# EAGLE design BQ2000 v3 (EAGLE 7.6.0)
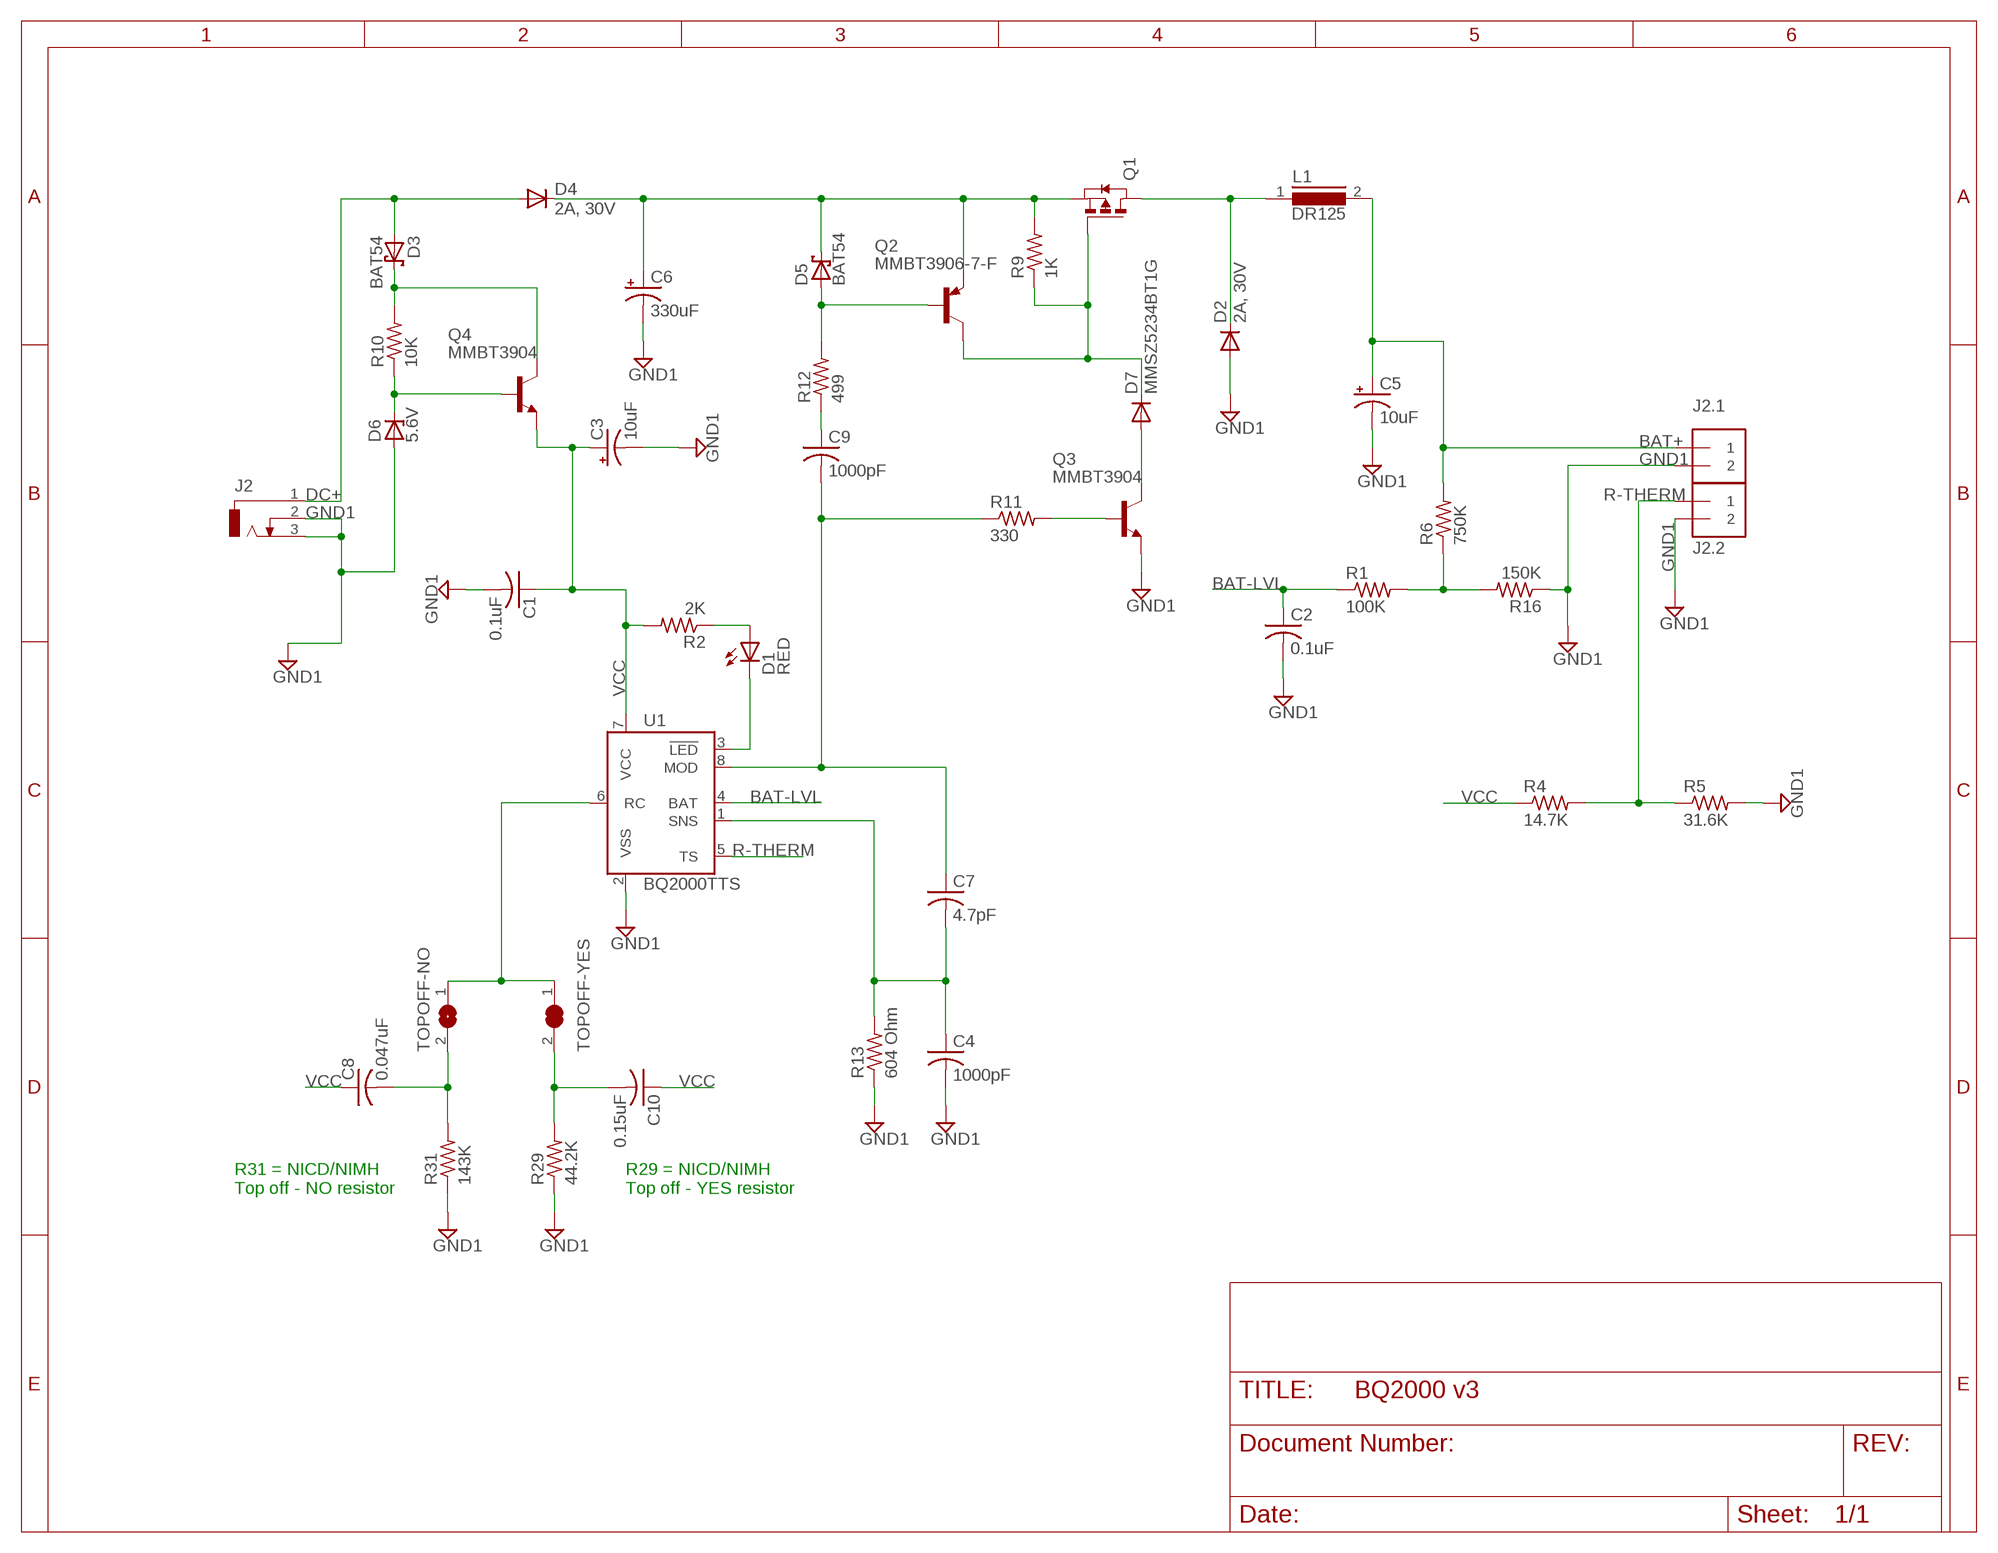
[diagram p0: schematic, sheet 1]

## Parts
C1  0.1uF  C-USC0603K  [C0603K]
C2  0.1uF  C-USC0603K  [C0603K]
C3  10uF  CPOL-USC  [PANASONIC_C]
C4  1000pF  C-USC0603K  [C0603K]
C5  10uF  CPOL-USC  [PANASONIC_C]
C6  330uF  CPOL-USE  [PANASONIC_E]
C7  4.7pF  C-USC0603K  [C0603K]
C8  0.047uF  C-USC0603K  [C0603K]
C9  1000pF  C-USC0603K  [C0603K]
C10  0.15uF  C-USC0603K  [C0603K]
D1  RED  LEDCHIPLED_0805  [CHIPLED_0805]
D2  2A, 30V  DIODE-SMB  [SMB]
D3  BAT54  [SOT23]
D4  2A, 30V  DIODE-SMB  [SMB]
D5  BAT54  [SOT23]
D6  5.6V  ZENER-DIODESOT23  [SOT23]
D7  MMSZ5234BT1G  DIODE-SOD123  [SOD123]
J2  DCJ0303  [DCJ0303]
J2.1  1X2-3.5MM  [1X2-3.5MM]
J2.2  1X2-3.5MM  [1X2-3.5MM]
L1  DR125  [DR125]
Q1  PMOSSOT23-6  [SOT23-6]
Q2  MMBT3906-7-F  MMBT3906LT1-PNP-SOT23-BEC  [SOT23-BEC]
Q3  MMBT3904  MMBT3904LT1-NPN-SOT23-BEC  [SOT23-BEC]
Q4  MMBT3904  MMBT3904LT1-NPN-SOT23-BEC  [SOT23-BEC]
R1  100K  R-US_R0603  [R0603]
R2  2K  R-US_R0603  [R0603]
R4  14.7K  R-US_R0603  [R0603]
R5  31.6K  R-US_R0603  [R0603]
R6  750K  R-US_R0603  [R0603]
R9  1K  R-US_R0603  [R0603]
R10  10K  R-US_R0603  [R0603]
R11  330  R-US_R0603  [R0603]
R12  499  R-US_R0603  [R0603]
R13  604 Ohm  R-US_R0603  [R0603]
R16  150K  R-US_R0603  [R0603]
R29  44.2K  R-US_R0603  [R0603]
R31  143K  R-US_R0603  [R0603]
TOPOFF-NO  SOLDERJUMPER_OPEN  [SOLDERJUMPER_OPEN]
TOPOFF-YES  SOLDERJUMPER_CLOSED"  [SOLDERJUMPER_CLOSED]
U1  BQ2000TTS  [TSSOP8]

## Nets
BAT+: C5.+ J2.1.1 L1.2 R6.2
BAT-LVL: C2.1 R1.1 U1.4(BAT)
DC+: D3.1(A) D4.A J2.1
GND1: C1.2 C2.2 C3.- C4.2 C5.- C6.- D2.A D6.1(A) J2.1.2 J2.2 J2.2.2 J2.3 Q3.E R5.2 R13.1 R16.1 R29.1 R31.1 U1.2(VSS)
N$1: D3.3(C) Q4.C R10.2
N$2: D6.3(C) Q4.B R10.1
N$3: TOPOFF-NO.1 TOPOFF-YES.1 U1.6(RC)
N$5: D1.A R2.1
N$6: D1.C U1.3(!LED)
N$7: C4.1 C7.2 R13.2 U1.1(SNS)
N$8: C7.1 C9.2 R11.1 U1.8(MOD)
N$9: R1.2 R6.1 R16.2
N$10: C6.+ D4.C D5.3(C) Q1.4(S) Q2.E R9.2
N$11: D5.1(A) Q2.B R12.2
N$12: C9.1 R12.1
N$14: Q3.B R11.2
N$15: D7.A Q3.C
N$16: D7.C Q1.3(G) Q2.C R9.1
N$17: D2.C L1.1 Q1.1(D) Q1.2(D) Q1.5(D) Q1.6(D)
N$18: C10.2 R29.2 TOPOFF-YES.2
N$30: C8.2 R31.2 TOPOFF-NO.2
R-THERM: J2.2.1 R4.2 R5.1 U1.5(TS)
VCC: C1.1 C3.+ C8.1 C10.1 Q4.E R2.2 R4.1 U1.7(VCC)

## Notes on the sheet
- R31 = NICD/NIMH
  Top off - NO resistor
- R29 = NICD/NIMH
  Top off - YES resistor

## Library data of the parts
C1 C2 = rcl:C-US: CAPACITOR, American symbol; MPN: C0603C104K5RACTU
C3 C5 = rcl:CPOL-US: POLARIZED CAPACITOR, American symbol; MPN: EEE-FK1E100R
C4 C9 = rcl:C-US: CAPACITOR, American symbol; MPN: C0603C102K5RACTU
C6 = rcl:CPOL-US: POLARIZED CAPACITOR, American symbol; MPN: EEE-FK1E331GP
C7 = rcl:C-US: CAPACITOR, American symbol; MPN: C0603C479D5GACTU
C8 = rcl:C-US: CAPACITOR, American symbol; MPN: C0603C473K3RACTU
C10 = rcl:C-US: CAPACITOR, American symbol; MPN: C0603C154K4RACTU
D1 = led:LED: LED OSRAM: - CHIPLED LG R971, LG N971, LY N971, LG Q971, LY Q971, LO R971, LY R971 LH N974, LH R974 LS Q976, LO Q976, LY Q976 LO Q996 - Hyper CHIPLED LW Q18S LB Q993, LB Q99A, LB R99A - SideLED LS A670, LO A670, LY A670, LG A670, LP A670 LB A673, LV A673, LT A673, LW A673 LH A674 LY A675 LS A676, LA A676, LO A676, LY A676, LW A676 LS A679, LY A679, LG A679 - Hyper Micro SIDELED® LS Y876, LA Y876, LO Y876, LY Y876 LT Y87S - SmartLED LW L88C, LW L88S LB L89C, LB L89S, LG L890 LS L89K, LO L89K, LY L89K LS L896, LA L896, LO L896, LY L896 - TOPLED LS T670, LO T670, LY T670, LG T670, LP T670 LSG T670, LSP T670, LSY T670, LOP T670, LYG T670 LG T671, LOG T671, LSG T671 LB T673, LV T673, LT T673, LW T673 LH T674 LS T676, LA T676, LO T676, LY T676, LB T676, LH T676, LSB T676, LW T676 LB T67C, LV T67C, LT T67C, LS T67K, LO T67K, LY T67K, LW E67C LS E67B, LA E67B, LO E67B, LY E67B, LB E67C, LV E67C, LT E67C LW T67C LS T679, LY T679, LG T679 LS T770, LO T770, LY T770, LG T770, LP T770 LB T773, LV T773, LT T773, LW T773 LH T774 LS E675, LA E675, LY E675, LS T675 LS T776, LA T776, LO T776, LY T776, LB T776 LHGB T686 LT T68C, LB T68C - Hyper Mini TOPLED® LB M676 - Mini TOPLED Santana® LG M470 LS M47K, LO M47K, LY M47K Source: http://www.osram.convergy.de LUXEON: - LUMILED® LXK2-PW12-R00, LXK2-PW12-S00, LXK2-PW14-U00, LXK2-PW14-V00 LXK2-PM12-R00, LXK2-PM12-S00, LXK2-PM14-U00 LXK2-PE12-Q00, LXK2-PE12-R00, LXK2-PE12-S00, LXK2-PE14-T00, LXK2-PE14-U00 LXK2-PB12-K00, LXK2-PB12-L00, LXK2-PB12-M00, LXK2-PB14-N00, LXK2-PB14-P00, LXK2-PB14-Q00 LXK2-PR12-L00, LXK2-PR12-M00, LXK2-PR14-Q00, LXK2-PR14-R00 LXK2-PD12-Q00, LXK2-PD12-R00, LXK2-PD12-S00 LXK2-PH12-R00, LXK2-PH12-S00 LXK2-PL12-P00, LXK2-PL12-Q00, LXK2-PL12-R00 Source: www.luxeon.com KINGBRIGHT: KA-3528ASYC Source: www.kingbright.com; MPN: AP2012SRCPRV
D2 D4 = diode:DIODE-: DIODE; MPN: B230A-13-F
D3 D5 = diode:BAT54: Schottky Diodes Source: Fairchild .. BAT54.pdf; MPN: BAT54
D6 = diode:ZENER-DIODE: Z-Diode; MPN: BZX84C5V6
D7 = diode:DIODE-: DIODE; MPN: MMSZ5234BT1G
J2 = con-jack:DCJ0303: DC POWER JACK Source: DCJ0303.pdf; OC_FARNELL: unknown; OC_NEWARK: unknown
J2.1 J2.2 = adafruit:1X2: 3.5mm Terminal block http://www.ladyada.net/library/pcb/eaglelibrary.html
L1 = inductors:DR125: High Power Density, High Efficiency, Shielded Inductors Source: coiltronics_dr_series.pdf; MPN: CDRH125NP-101MC
Q1 = zetex:PMOSSOT23-6: P-CHANNEL ENHANCEMENT MODE MOSFET Source: Data sheet <http://www.diodes.com/zetex/_pdfs/3.0/pdf/ZXMP10A17E6.pdf> ZXMP10A17E6; MPN: FDC658AP; OC_FARNELL: unknown; OC_NEWARK: unknown
Q2 = transistor:*-PNP-: PNP Transistror; MPN: MMBT3906-7-F
Q3 Q4 = transistor:*-NPN-: NPN Transistror BF959 corrected 2008.03.06
R1 = rcl:R-US_: RESISTOR, American symbol; MPN: CRCW0603100KFKEA
R2 = rcl:R-US_: RESISTOR, American symbol; MPN: CRCW06032K00FKEA
R4 = rcl:R-US_: RESISTOR, American symbol; MPN: CRCW060314K7FKEA
R5 = rcl:R-US_: RESISTOR, American symbol; MPN: CRCW060331K6FKEA
R6 = rcl:R-US_: RESISTOR, American symbol; MPN: CRCW0603750KFKEA
R9 = rcl:R-US_: RESISTOR, American symbol; MPN: CRCW06031K00FKEA
R10 = rcl:R-US_: RESISTOR, American symbol; MPN: CRCW060310K0FKEA
R11 = rcl:R-US_: RESISTOR, American symbol; MPN: CRCW0603330RFKEA
R12 = rcl:R-US_: RESISTOR, American symbol; MPN: CRCW0603499RFKEA
R13 = rcl:R-US_: RESISTOR, American symbol; MPN: CRCW0603604RFKEA
R16 R29 R31 = rcl:R-US_: RESISTOR, American symbol
TOPOFF-NO = ChicagoRobotics:SOLDERJUMPER_OPEN: Solder Jumper - Closed These solder jumpers are closed by default CLOSEDWIRE - 10 mil trace between pads that can be cut and resoldered later
TOPOFF-YES = ChicagoRobotics:SOLDERJUMPER_CLOSED: Solder Jumper - Closed These solder jumpers are closed by default CLOSEDWIRE - 10 mil trace between pads that can be cut and resoldered later
U1 = texas:BQ2000TTS: CHARGE MANAGEMENT IC; MPN: 595-BQ2000PWR; OC_FARNELL: unknown; OC_NEWARK: unknown

## Board
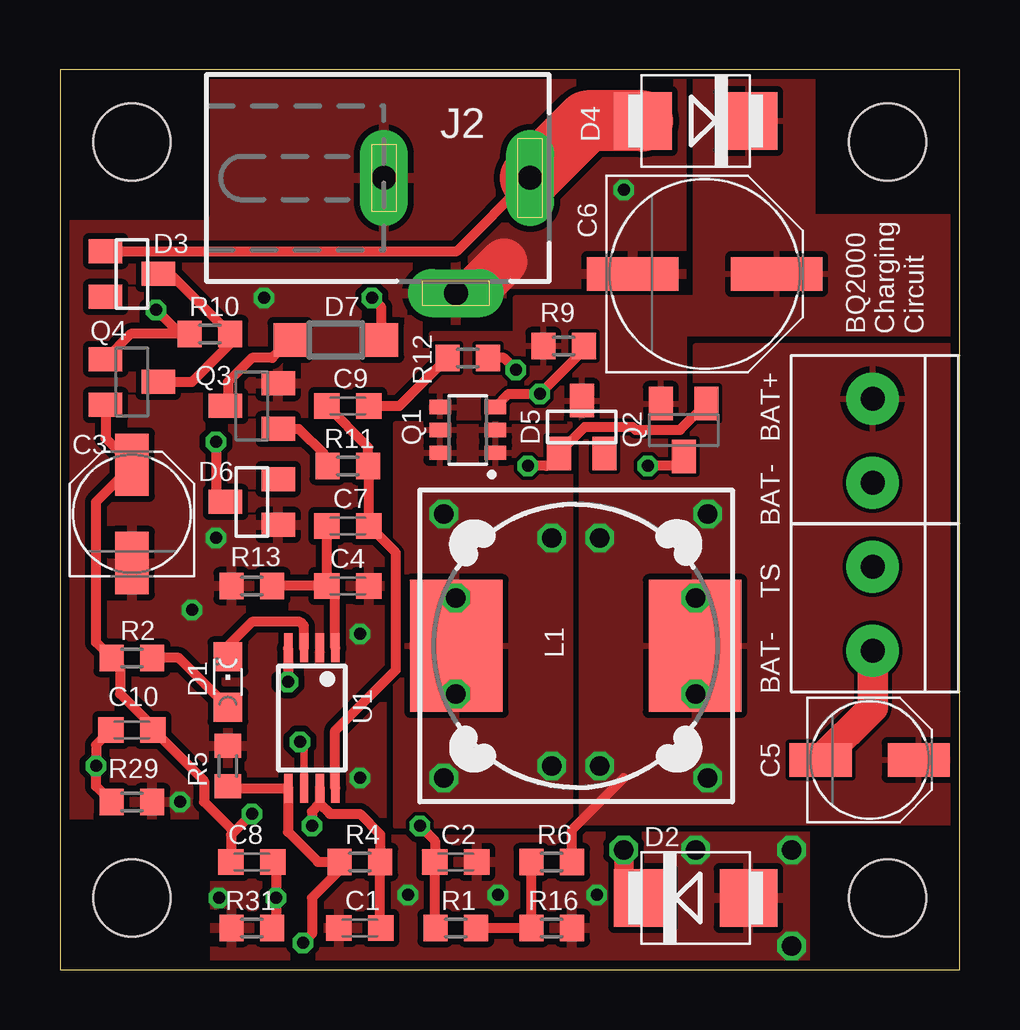
[diagram p1: board, top side]
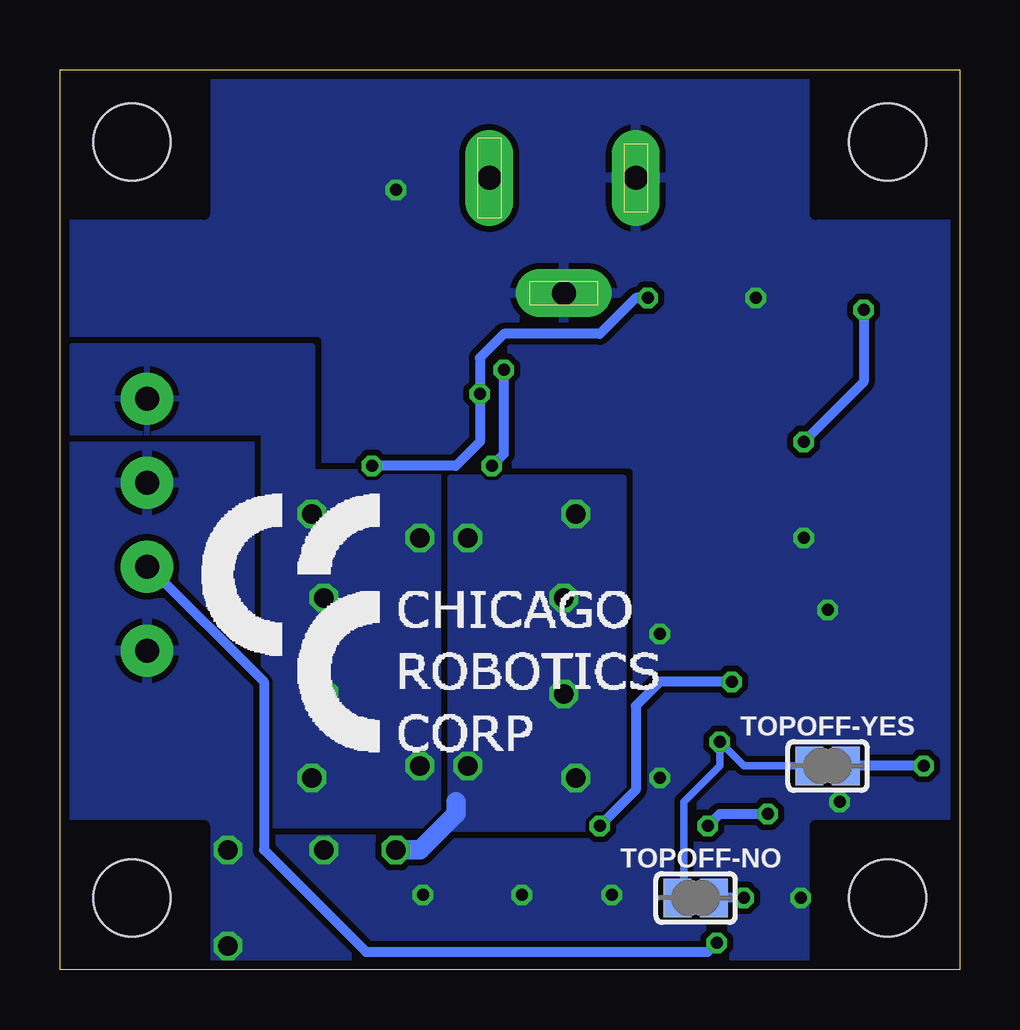
[diagram p2: board, bottom side, seen from below]

Size 37.5 x 37.5 mm. Coordinates in mm from the lower left corner, seen from the top.
Outline: 0,0 37.5,0 37.5,37.5 0,37.5 0,0
Copper layers (1*16): Top 0.0356mm / dielectric 1.5011mm / Bottom 0.0356mm
Design rules "oshpark-2layer *": minimum track width 6mil, minimum drill 13mil, track to track 6mil, track to pad 6mil, pad to pad 6mil, via to via 6mil, smd to smd 6mil, copper to edge 15mil, drill to drill 6mil, minimum pad ring 7mil, minimum via ring 7mil, stop-mask expansion 4mil, vias tented up to drill 0mil, thermal gap 10mil
Holes 3.2 mm at 3,3 3,34.5 34.5,34.5 34.5,3
tRestrict: area 0,0 to 6,6; area 0,31.5 to 6,37.5; area 31.5,0 to 37.5,6; area 31.5,31.5 to 37.5,37.5
bRestrict: area 0,0 to 6,6; area 0,31.5 to 6,37.5; area 31.5,31.5 to 37.5,37.5; area 31.5,0 to 37.5,6

### Footprints (pad centres in the part's own frame; a part is rotated, then mirrored left to right if it is on the bottom)
C0603K = smd 1.05 x 1.08: 1 -0.875,0; 2 0.875,0
PANASONIC_C = smd 2.6 x 1.4: + 2.05,0; - -2.05,0
PANASONIC_E = smd 3.8 x 1.4: + 3,0; - -3,0
CHIPLED_0805 = smd 1.2 x 1.2: A 0,-1.05; C 0,1.05
SMB = smd 2.4 x 2.4: A 2.2,0; C -2.2,0
SOT23 = smd 1 x 1.4: 1 -0.95,-1.1; 2 0.95,-1.1; 3 0,1.1
SOD123 = smd 1.4 x 1.4: A 1.9,0; C -1.9,0
DCJ0303 = drill 1 pad 2 long: 1 0,3.1; 2 4.8,0; 3 0,-3
1X2-3.5MM = drill 1 pad 2.184: 1 1.8,0; 2 -1.7,0
DR125 = smd 3.85 x 5.5: 1 -4.975,0; 2 4.975,0
SOT23-6 = smd 0.6 x 0.9: 1 -0.95,-1.15; 2 0,-1.15; 3 0.95,-1.15; 4 0.95,1.15; 5 0,1.15; 6 -0.95,1.15
SOT23-BEC = smd 1 x 1.4: B -0.95,-1.1; C 0,1.1; E 0.95,-1.1
R0603 = smd 1 x 1.1: 1 -0.85,0; 2 0.85,0
SOLDERJUMPER_OPEN = smd 1.168 x 1.6: 1 -0.762,0; 2 0.762,0
SOLDERJUMPER_CLOSED = smd 1.168 x 1.6: 1 -0.762,0; 2 0.762,0 | smd 1.27 x 0.635: P$1 0,0
TSSOP8 = smd 1.2 x 0.35: 1 -2.925,0.975; 2 -2.925,0.325; 3 -2.925,-0.325; 4 -2.925,-0.975; 5 2.925,-0.975; 6 2.925,-0.325; 7 2.925,0.325; 8 2.925,0.975

### Placement (x,y rotation side)
C1  12.5,1.75 180 top
C2  16.5,4.5 0 top
C3  3,19 90 top
C4  12,16 0 top
C5  33.75,8.75 0 top
C6  26.88,29 0 top
C7  12,18.5 180 top
C8  8,4.5 0 top
C9  12,23.5 180 top
C10  3,10 180 top
D1  7,12 0 top
D2  26.5,3 0 top
D3  3,29 270 top
D4  26.5,35.38 180 top
D5  21.75,22.62 0 top
D6  8,19.5 90 top
D7  11.5,26.25 180 top
J2  16.5,33 270 top
J2.1  33.88,22 90 top
J2.2  33.88,15 90 top
L1  21.5,13.5 0 top
Q1  17,22.5 90 top
Q2  26,22.5 180 top
Q3  8,23.5 90 top
Q4  3,24.5 270 top
R1  16.5,1.75 0 top
R2  3,13 180 top
R4  12.5,4.5 180 top
R5  7,8.5 90 top
R6  20.5,4.5 0 top
R9  21,26 180 top
R10  6.25,26.5 0 top
R11  12,21 180 top
R12  17,25.5 0 top
R13  8,16 0 top
R16  20.5,1.75 180 top
R29  3,7 180 top
R31  8,1.75 0 top
TOPOFF-NO  11,3 0 bottom
TOPOFF-YES  5.5,8.5 0 bottom
U1  10.5,10.5 270 top
U$1  [CRC-LOGO]  22.12,13.62 0 bottom

### Tracks (layer width: path | path; a pad name or v marks a point on that pad's centre or on a via)
BAT+  (via drill 0.8)
  Top 0.406: R6.2 21.35,5.85 23.5,8
  other vias: 22.5,18 27,19 26.5,15.5 22.5,8.5 27,8 26.5,11.5
  pour Top: 21.75,6.12 21.75,22.5 26.5,22.5 26.5,26 37.5,26 37.5,6.12
  pour Bottom: 21.75,20.75 21.75,6 29,6 29,22.38 37,22.38 37,26 27,26 27,20.75
BAT-LVL  (via drill 0.5)
  Top 0.305: R1.1 15.62,1.77 | U1.4 9.5,13.4
  Top 0.406: 15.62,1.77 C2.1 15.62,5.38 v15,6 | 9.5,13.4 v9.5,12
  Bottom 0.406: v9.5,12 12.5,12 13.5,11 13.5,7.5 v15,6
DC+
  Top 0.406: D3.1 16.55,29.95 J2.1
  Top 2.54: D4.A 21.98,35.38 J2.1
GND1  (via drill 0.5, 0.8)
  Top 1.27: J2.2.2 33.88,10.93 C5.-
  Top 1.93: J2.2 17.2,28.2 18.5,29.5
  other vias: 6.62,3 6.5,18 12.5,14 5,7 18.25,3.12 22.38,3.12 14.5,3.12 12.5,8 30.5,5 30.5,1 26.5,5 5.5,15 8.5,28 23.5,32.5
  pour Bottom (isolate 0.254, rank 3): 0,37.5 0,0 37.5,0 37.5,37.5
  pour Top (isolate 0.254, rank 3): 0,37.5 0,0 37.5,0 37.5,37.5
N$1
  Top 0.406: Q4.C 5.5,24.5 7.1,26.1 R10.2 4.6,29 D3.3
N$2  (via drill 0.5)
  Top 0.406: Q4.B 2.95,26.5 R10.1 5,26.5 v4,27.5 | v6.5,22 6.5,19.9 D6.3
  Bottom 0.406: v4,27.5 4,24.5 v6.5,22
N$3  (via drill 0.5)
  Top 0.305: U1.6 10.18,9.32 v10,9.5
  Bottom 0.305: TOPOFF-NO.1 11.5,3.26 11.5,7 10,8.5 v10,9.5 9,8.5 TOPOFF-YES.1
N$5
  Top 0.406: D1.A 4.95,13 R2.1
N$6
  Top 0.305: 7,13.5 D1.C
  Top 0.406: U1.3 10.18,14.32 10,14.5 8,14.5 7,13.5
N$7
  Top 0.305: 11.47,15.65 C4.1
  Top 0.406: U1.1 11.47,15.65 | R13.2 C4.1 C7.2
N$8
  Top 0.305: 12.88,20.98 R11.1
  Top 0.406: U1.8 11.47,9.97 14,12.5 14,17.38 C7.1 12.88,20.98 | R11.1 12.85,21.77 C9.2
N$9
  Top 0.406: R1.2 R16.2 R6.1
N$10
  pour Top: 26.5,37.5 37.5,37.5 37.5,26.5 26,26.5 26,23 15.5,23 15.5,26.5 19,26.5 19,28 26.5,28
N$11  (via drill 0.5)
  Top 0.254: 21.02,21.52 D5.1 20.27,21
  Top 0.406: Q2.B 25.85,22.5 24,22.5 23.88,22.62 21.88,22.62 20.8,21.55 D5.1 | 20.27,21 v19.5,21 | v19,25 18.5,25.5 R12.2
  Bottom 0.406: v19.5,21 19,21.5 v19,25
N$12
  Top 0.406: C9.1 14.15,23.5 R12.1
N$14
  Top 0.406: Q3.B 9.95,22.55 11,21.5 11,21.15 R11.2
N$15
  Top 0.406: D7.A 8.85,25.5 8,25.5 7,24.5 7,23.6 Q3.C
N$16  (via drill 0.5)
  Top 0.254: 21.85,25.85 R9.1 | Q2.C 25.6,21
  Top 0.406: Q1.3 18.7,24 v20,24 21.85,25.85 | 25.6,21 v24.5,21 | D7.C 13.4,27.6 v13,28
  Bottom 0.406: v13,28 13.5,28 15,26.5 19,26.5 20,25.5 v20,24 20,22 21,21 v24.5,21
N$17  (via drill 0.8)
  Top 0.813: L1.1 16.52,11.47 | v23.5,5 23.5,3.8 D2.C
  Bottom 0.813: v23.5,5 22.5,5 21,6.5 21,7
  other vias: 16,8 16.5,11.5 20.5,8.5 16.5,15.5 16,19 20.5,18
  pour Top (rank 2): 14,22.75 21.25,22.75 21.25,6 14,6
  pour Bottom: 14,20.5 21.25,20.5 21.25,5.88 14,5.88
N$18  (via drill 0.5)
  Top 0.406: R29.2 1.5,7.65 v1.5,8.5 1.5,9.38 C10.2
  Bottom 0.406: v1.5,8.5 TOPOFF-YES.2
N$30  (via drill 0.5)
  Top 0.406: C8.2 9,4.38 v9,3 9,1.9 R31.2
  Bottom 0.406: v9,3 TOPOFF-NO.2
R-THERM  (via drill 0.5)
  Top 0.254: U1.5 9.5,7.55
  Top 0.305: R4.2 11.65,4.15
  Top 0.406: R5.1 7.08,7.58 U1.5 | 9.5,7.55 9.5,5.75 10.75,4.5 R4.2 | 11.65,4.15 10.5,3 10.5,1.5 v10.12,1.12
  Bottom 0.406: J2.2.1 33.8,16.8 29,12 29,5 24.75,0.75 10.5,0.75 v10.12,1.12
VCC  (via drill 0.5)
  Top 0.305: 3,21 C3.+ | R2.2 2.5,12.65 | 3.88,10.12 C10.1 | 7.12,5.88 7.12,5.62
  Top 0.406: Q4.E 1.9,22.15 C3.+ | 13.35,1.73 R4.1 13.35,5.65 12.5,6.5 11.25,6.5 10.82,6.92 | U1.7 10.82,6.92 | R2.2 1.5,13.65 1.5,19.5 3,21 | 2.5,12.65 2.5,11.5 3.88,10.12 | C10.1 6,7.88 6,7 7.12,5.88 | 10.82,6.92 10.5,6.6 v10.5,6 | v8,6.5 7.12,5.62 C8.1 | 13.35,1.52 13.35,1.73 | 13.35,1.73 C1.1
  Bottom 0.406: v10.5,6 10,6.5 v8,6.5

### Text on the board
tNames: BQ2000 / Charging / Circuit | BAT+ | BAT- | TS | BAT-